# Altium schematic sheet ETH1G_RJ45wLED.SchDoc
size A3; SheetNumber: 5; SheetTotal: 22
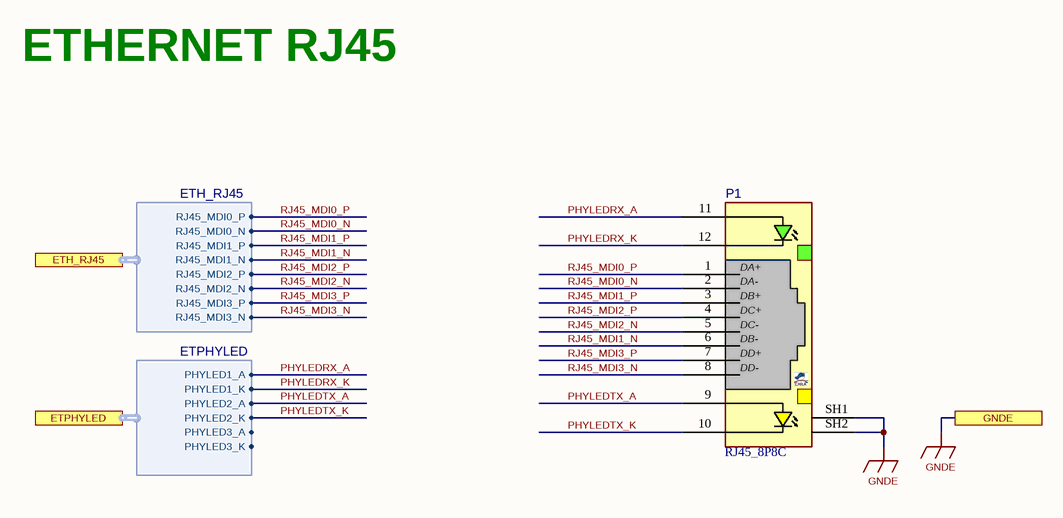
[diagram p0: ETH1G_RJ45wLED.SchDoc]

## Parts
P1  RJ45_8P8C  [RJ45_8S_RA_TU_L]

## Ports
ETH_RJ45 (harness ETH_RJ45), ETPHYLED (harness ETPHYLED), GNDE

## Harnesses
ETPHYLED: PHYLED1_A, PHYLED1_K, PHYLED2_A, PHYLED2_K, PHYLED3_A, PHYLED3_K
ETH_RJ45: RJ45_MDI0_P, RJ45_MDI0_N, RJ45_MDI1_P, RJ45_MDI1_N, RJ45_MDI2_P, RJ45_MDI2_N, RJ45_MDI3_P, RJ45_MDI3_N

## Nets
GNDE: P1.SH1 P1.SH2 ; port GNDE
PHYLEDRX_A: P1.11(GLED+) ; port ETPHYLED.PHYLED1_A
PHYLEDRX_K: P1.12(GLED-) ; port ETPHYLED.PHYLED1_K
PHYLEDTX_A: P1.9(YLED+) ; port ETPHYLED.PHYLED2_A
PHYLEDTX_K: P1.10(YLED-) ; port ETPHYLED.PHYLED2_K
RJ45_MDI0_N: P1.2(DA-) ; port ETH_RJ45.RJ45_MDI0_N
RJ45_MDI0_P: P1.1(DA+) ; port ETH_RJ45.RJ45_MDI0_P
RJ45_MDI1_N: P1.6(DB-) ; port ETH_RJ45.RJ45_MDI1_N
RJ45_MDI1_P: P1.3(DB+) ; port ETH_RJ45.RJ45_MDI1_P
RJ45_MDI2_N: P1.5(DC-) ; port ETH_RJ45.RJ45_MDI2_N
RJ45_MDI2_P: P1.4(DC+) ; port ETH_RJ45.RJ45_MDI2_P
RJ45_MDI3_N: P1.8(DD-) ; port ETH_RJ45.RJ45_MDI3_N
RJ45_MDI3_P: P1.7(DD+) ; port ETH_RJ45.RJ45_MDI3_P

## Notes on the sheet
- ETHERNET RJ45

## Library data of the parts
P1 = RJ45_8S_RA_TU_L: RJ45, 8P+LED, SHIELDED, RightAngle, TabUP; MANF: WURTH; MANF_P#: 615008137421; PRICE: 1.2$; VALUE: RJ45_8P8C